# EAGLE design receiver (EAGLE 6.3)
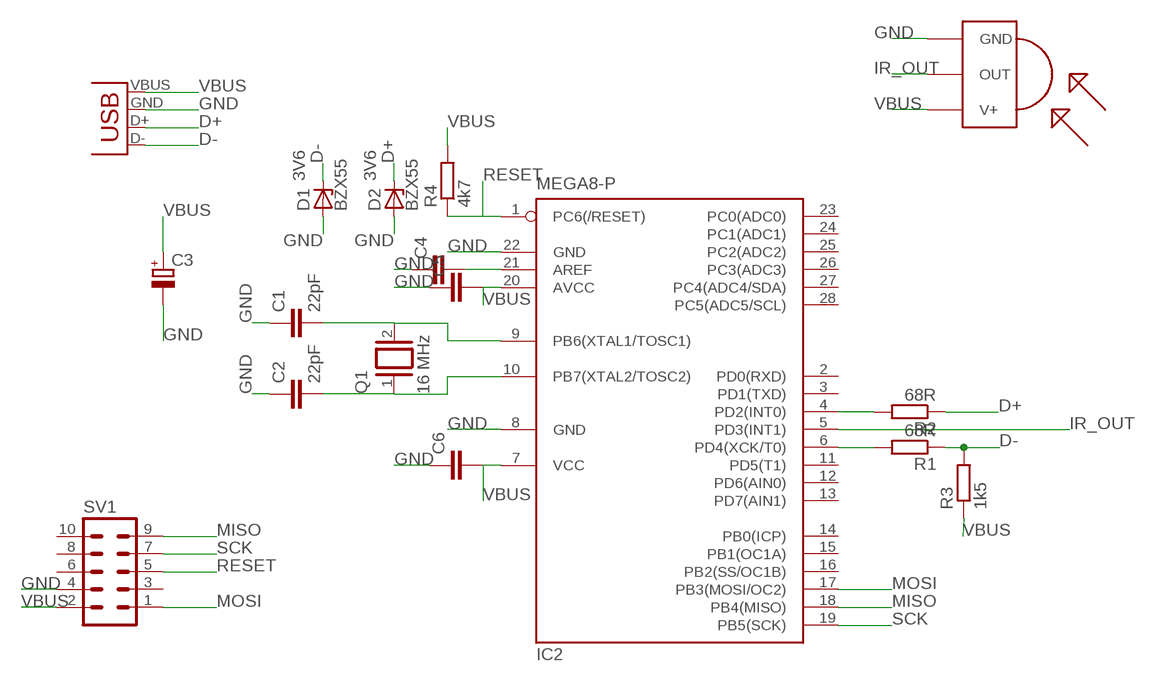
[diagram p0: schematic, sheet 1]

## Parts
C1  22pF  C-EU050-025X075  [C050-025X075]
C2  22pF  C-EU050-025X075  [C050-025X075]
C3  CPOL-EUE2-5  [E2-5]
C4  C-EU050-024X044  [C050-024X044]
C5  C-EU050-024X044  [C050-024X044]
C6  C-EU050-024X044  [C050-024X044]
D1  BZX55  [DO35Z10]
D2  BZX55  [DO35Z10]
IC2  MEGA8-P  [DIL28-3]
JP1  USB-A-H  [USB-A-H]
Q1  16 MHz  XTAL/S  [QS]
R1  68R  R-EU_0204/7  [0204/7]
R2  68R  R-EU_0204/7  [0204/7]
R3  1k5  R-EU_0204/7  [0204/7]
R4  4k7  R-EU_0204/7  [0204/7]
SV1  ML10L  [ML10L]
TSOP1  TSOP1730  [TSOP17XX]

## Nets
COS: C2.2 IC2.10(PB7(XTAL2/TOSC2)) Q1.1
D+: D2.C JP1.D+(D-) R2.1
D-: D1.C JP1.D-(D+) R1.1 R3.2
GND: C1.1 C2.1 C3.- C4.1 C5.1 C6.1 D1.A D2.A IC2.8(GND) IC2.22(GND) JP1.GND(VBUS) SV1.4 TSOP1.GND
IR_OUT: IC2.5(PD3(INT1)) TSOP1.OUT
MISO: IC2.18(PB4(MISO)) SV1.9
MOSI: IC2.17(PB3(MOSI/OC2)) SV1.1
N$1: C4.2 IC2.21(AREF)
N$2: C1.2 IC2.9(PB6(XTAL1/TOSC1)) Q1.2
N$3: IC2.6(PD4(XCK/T0)) R1.2
N$4: IC2.4(PD2(INT0)) R2.2
RESET: IC2.1(PC6(/RESET)) R4.1 SV1.5
SCK: IC2.19(PB5(SCK)) SV1.7
VBUS: C3.+ C5.2 C6.2 IC2.7(VCC) IC2.20(AVCC) JP1.VBUS(GND) R3.1 R4.2 SV1.2 TSOP1.V+
Unconnected: IC2.2(PD0(RXD)) IC2.3(PD1(TXD)) IC2.11(PD5(T1)) IC2.12(PD6(AIN0)) IC2.13(PD7(AIN1)) IC2.14(PB0(ICP)) IC2.15(PB1(OC1A)) IC2.16(PB2(SS/OC1B)) IC2.23(PC0(ADC0)) IC2.24(PC1(ADC1)) IC2.25(PC2(ADC2)) IC2.26(PC3(ADC3)) IC2.27(PC4(ADC4/SDA)) IC2.28(PC5(ADC5/SCL)) SV1.3 SV1.6 SV1.8 SV1.10

## Notes on the sheet
- 3V6 | 3V6

## Library data of the parts
C1 C2 = resistor:C-EU: CAPACITOR, European symbol
C3 = rcl:CPOL-EU: POLARIZED CAPACITOR, European symbol
C4-C6 = rcl:C-EU: CAPACITOR, European symbol
D1 D2 = diode:BZX55: Z DIODE
IC2 = atmel:MEGA8-P: MICROCONTROLLER 8 Kbytes FLASH, 1 kbytes SRAM, 512 bytes EEPROM, USART, 4-channel 10 bit ADC, 2-channel 8 bit ADC Pin compatible with Atmega48, ATMega88, ATMega168 Source: avr.lbr; OC_FARNELL: unknown; OC_NEWARK: unknown
JP1 = SparkFun-Connectors:USB: USB Connectors USB-B-PTH is fully proven SKU : PRT-00139/CONN-08278 USB-miniB is fully proven SKU : PRT-00587 USB-A-PCB is untested. USB-A-H is throughly reviewed, but untested. Spark Fun Electronics SKU : PRT-00437 USB-B-SMT is throughly reviewed, but untested. Needs silkscreen touching up. USB-A-S has not been used/tested USB-MB-H has not been used/tested USB-MICROB has been used. CONN-09505
Q1 = special:XTAL/S: CRYSTAL
R1-R4 = rcl:R-EU_: RESISTOR, European symbol
SV1 = con-harting-ml:ML10: HARTING; OC_FARNELL: unknown; OC_NEWARK: unknown
TSOP1 = tsop:TSOP1730: IR Receiver and Demodulator

## Board
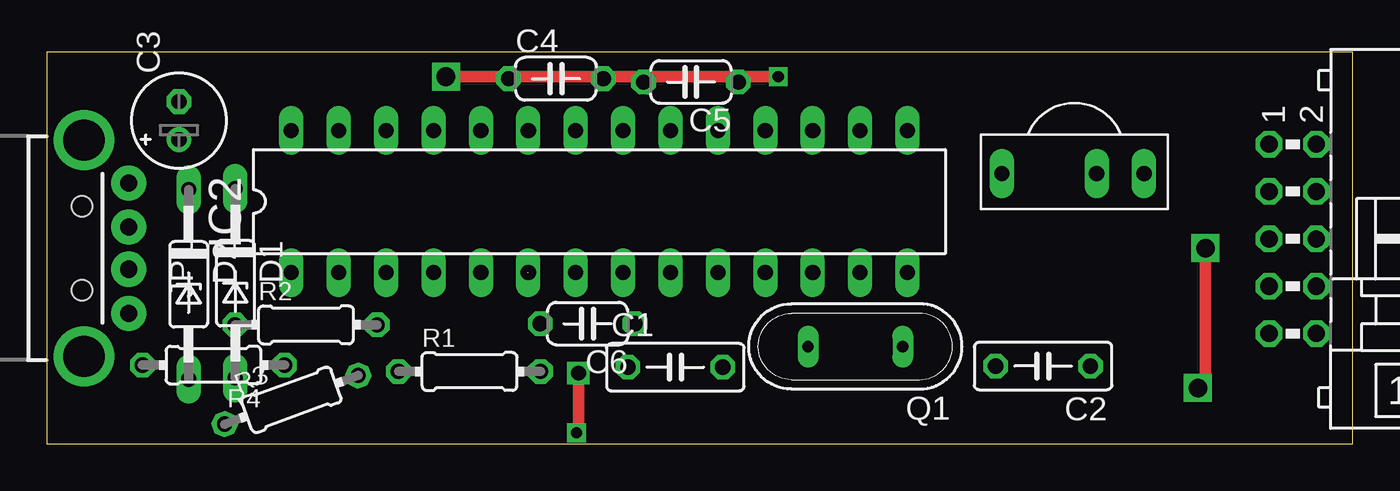
[diagram p1: board, top side]
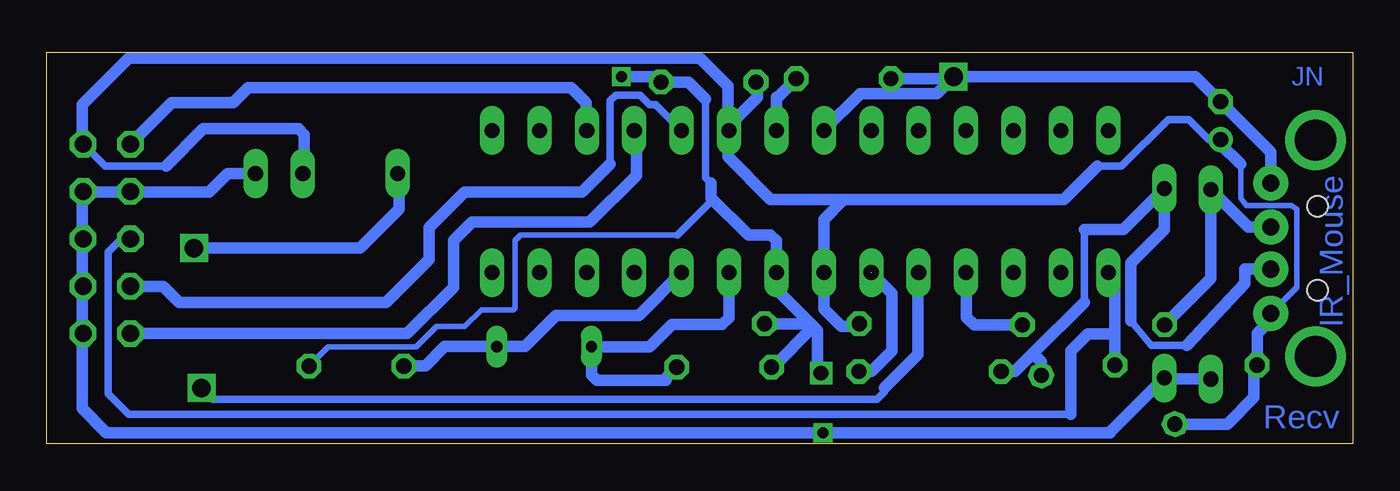
[diagram p2: board, bottom side, seen from below]

Size 70 x 21 mm. Coordinates in mm from the lower left corner, seen from the top.
Outline: 0,0 70,0 70,21 0,21 0,0
Copper layers (1*16): Top 0.035mm / dielectric 1.5mm / Bottom 0.035mm
Design rules "default": minimum track width 10mil, minimum drill 24mil, track to track 8mil, track to pad 8mil, pad to pad 8mil, via to via 8mil, smd to smd 8mil, copper to edge 40mil, drill to drill 8mil, minimum pad ring 10mil, minimum via ring 8mil, stop-mask expansion 4mil, vias tented up to drill 0mil, thermal gap 10mil

### Footprints (pad centres in the part's own frame; a part is rotated, then mirrored left to right if it is on the bottom)
C050-025X075 = drill 0.813 octagon: 1 -2.54,0; 2 2.54,0
E2-5 = drill 0.813 pad 1.27: + -1.016,0 | drill 0.813 pad 1.27 octagon: - 1.016,0
C050-024X044 = drill 0.813 octagon: 1 -2.54,0; 2 2.54,0
DO35Z10 = drill 0.813 long: A 5.08,0; C -5.08,0
DIL28-3 = drill 0.813 long: 1 -16.51,-3.81; 2 -13.97,-3.81; 3 -11.43,-3.81; 4 -8.89,-3.81; 5 -6.35,-3.81; 6 -3.81,-3.81; 7 -1.27,-3.81; 8 1.27,-3.81; 9 3.81,-3.81; 10 6.35,-3.81; 11 8.89,-3.81; 12 11.43,-3.81; 13 13.97,-3.81; 14 16.51,-3.81; 15 16.51,3.81; 16 13.97,3.81; 17 11.43,3.81; 18 8.89,3.81; 19 6.35,3.81; 20 3.81,3.81; 21 1.27,3.81; 22 -1.27,3.81; 23 -3.81,3.81; 24 -6.35,3.81; 25 -8.89,3.81; 26 -11.43,3.81; 27 -13.97,3.81; 28 -16.51,3.81
USB-A-H = drill 0.914 pad 1.88: D+ 2.4,1.127; D- 2.4,-1.127; GND 2.4,3.5; VBUS 2.4,-3.5 | drill 2.2: GND2 0,-5.8; GND3 0,5.8 | hole 1.1: -0.1,2.25; -0.1,-2.25
QS = drill 0.61 long: 1 -2.54,0; 2 2.54,0
0204/7 = drill 0.813 octagon: 1 -3.81,0; 2 3.81,0
ML10L = drill 0.914 octagon: 1 -5.08,-1.27; 2 -5.08,1.27; 3 -2.54,-1.27; 4 -2.54,1.27; 5 0,-1.27; 6 0,1.27; 7 2.54,-1.27; 8 2.54,1.27; 9 5.08,-1.27; 10 5.08,1.27
TSOP17XX = drill 0.813 long: GND -3.81,0; OUT 3.81,0; V+ -1.27,0

### Placement (x,y rotation side)
C1  33.69,4.12 0 top
C2  53.4,4.18 180 top
C3  7.09,17.34 90 top
C4  27.29,19.59 0 top
C5  34.53,19.41 180 top
C6  28.99,6.45 180 top
D1  10.11,8.62 270 top
D2  7.61,8.56 270 top
IC2  29.62,13 0 top
JP1  2,10.5 0 top
Q1  43.34,5.23 180 top
R1  22.66,3.89 0 top
R2  13.9,6.39 0 top
R3  13.12,2.37 20 top
R4  8.94,4.23 180 top
SV1  66.78,11 270 top
TSOP1  55,14.5 180 top

### Tracks (layer width: path | path; a pad name or v marks a point on that pad's centre or on a via)
COS
  Bottom 0.61: IC2.10 38.26,6.9 42.7,6.9 44.37,5.23 Q1.1 48.67,5.23 49.7,4.2 50.84,4.2 C2.2
D+
  Bottom 0.61: JP1.D+ 5.6,11.63 D2.C 7.61,8.87 R2.1
D-
  Bottom 0.406: 14.4,7.6 14.4,11.5 | 8.9,5.3 10.8,5.3 11.9,6.6
  Bottom 0.61: R1.1 18.11,3.89 17.15,4.85 | 17.15,4.85 14.4,7.6 | R3.2 16.7,4.4 17.15,4.85 | JP1.D- 5.78,9.37 5.78,8.62 8.9,5.3 | 14.4,11.5 12.31,11.5 D1.C 10.1,11.5 11.9,9.7 11.9,6.6
GND  (via drill 0.6, 0.8, 1)
  Top 0.61: v28.5,3.8 28.5,0.7 v28.4,0.6 | v21.4,19.7 v39.2,19.7
  Bottom 0.305: C2.1 54.92,5.2 50.2,5.2 49.1,6.3 47.6,6.3 46.7,7.2 45,7.2 44.9,7.3 44.9,10.9 44.6,11.2 36.2,11.2
  Bottom 0.406: 34.7,18.5 34.7,14.3 34.4,14 | 36.2,11.2 34.4,13 34.4,13.2
  Bottom 0.61: 29.05,6.45 30.89,8.29 IC2.8 30.9,10.9 31.2,11.2 32.4,11.2 34.4,13.2 34.4,14 | v28.5,3.8 28.7,4 28.7,6.1 28.9,6.3 | C6.1 29.05,6.45 | 29.05,6.45 28.9,6.3 | C1.1 31.08,4.12 28.9,6.3 | 34.7,18.5 35.61,19.41 C5.1 37.36,19.7 v39.2,19.7 | C4.1 21.51,19.59 v21.4,19.7 | IC2.22 28.35,16.85 26.4,18.8 22.3,18.8 v21.4,19.7 | v21.4,19.7 8.43,19.7 C3.- 4.4,15.67 JP1.GND | TSOP1.GND 60.3,14.5 61.3,13.5 68.01,13.5 SV1.4 68.1,13.49 68.1,1.9 66.8,0.6 v28.4,0.6 13,0.6 13,0.65 D1.A 10.05,3.48 D2.A
IR_OUT  (via drill 1)
  Top 0.61: v62.1,10.5 62.1,3.4 v61.7,3
  Bottom 0.406: v61.7,3 61.1,2.4 25.5,2.4 25.1,2.8 25.1,3
  Bottom 0.61: 25.1,3 23.3,4.8 23.3,9.16 IC2.5 | v62.1,10.5 53.2,10.5 51.1,12.6 51.1,14.41 TSOP1.OUT
MISO
  Bottom 0.61: SV1.9 50.68,5.92 48.2,8.4 48.2,10.9 47.2,11.9 40.9,11.9 38.4,14.4 38.4,16.7 IC2.18
MOSI
  Bottom 0.61: SV1.1 63.29,18.3 60,18.3 59.2,19.1 41.9,19.1 41.1,18.3 41.1,16.4 40.9,16.2 40.9,16.66 IC2.17
N$1
  Bottom 0.61: IC2.21 30.89,18.61 30.81,18.61 C4.2
N$2
  Bottom 0.61: IC2.9 33.43,6.77 33.8,6.4 36.5,6.4 37.7,5.2 40.77,5.2 Q1.2 40.8,3.7 40.5,3.4 36.8,3.4 36.8,3.55 C1.2
N$3  (1 unrouted)
  Bottom 0.61: IC2.6 24.7,8.08 24.7,5 25.8,3.9 R1.2
N$4
  Bottom 0.61: R2.2 20.29,6.39 20.7,6.8 20.7,9.16 IC2.4
RESET
  Bottom 0.406: SV1.5 66,11 66.7,10.3 66.7,2.7 65.6,1.6 15.1,1.6
  Bottom 0.61: R4.1 12.75,5.9 | 12.75,5.9 12.75,8.83 IC2.1 | 15.1,1.6 15.1,5 14.2,5.9 12.75,5.9
SCK
  Bottom 0.406: 39.8,15 39.8,18.4 39.5,18.7 38.2,18.7 37.7,18.2 37.36,18.2 IC2.19
  Bottom 0.61: SV1.7 63.76,8.46 62.9,7.6 51.8,7.6 49.5,9.9 49.5,11.6 47.6,13.5 41.3,13.5 39.8,15
VBUS
  Bottom 0.305: 6,15 6,13.2 5.7,12.8 3.3,12.8 3,12.6 3,8.4 JP1.VBUS
  Bottom 0.406: 63.6,14.9 66.87,14.9 SV1.2 | C3.+ 7.72,16.32 8.8,17.4 9.9,17.4 12.4,14.9 13.7,14.9
  Bottom 0.61: R4.2 5.13,4.07 | C6.2 26.6,6.3 27.4,6.3 28.35,7.25 IC2.7 28.35,12.05 27.3,13.1 | 33.5,16.74 IC2.20 33.43,17.07 31.9,18.6 31.9,19.32 C5.2 | 33.5,16.74 33.5,15.4 31.2,13.1 27.3,13.1 | 27.3,13.1 15.5,13.1 13.7,14.9 | R3.1 6.73,1.07 5.3,2.5 5.3,4.06 R4.2 | 33.5,16.74 33.5,19.2 35,20.7 65.6,20.7 68.1,18.2 68.1,16.13 SV1.2 | 63.6,14.9 61.6,16.9 56.5,16.9 56.2,16.6 56.2,14.57 TSOP1.V+ | R4.2 5.13,5.93 4.4,6.66 JP1.VBUS | C3.+ 7.09,16.09 6,15

### Text on the board
Bottom: JN | IR_Mouse | Recv